# EAGLE design TourisTech (EAGLE 9.6.2)
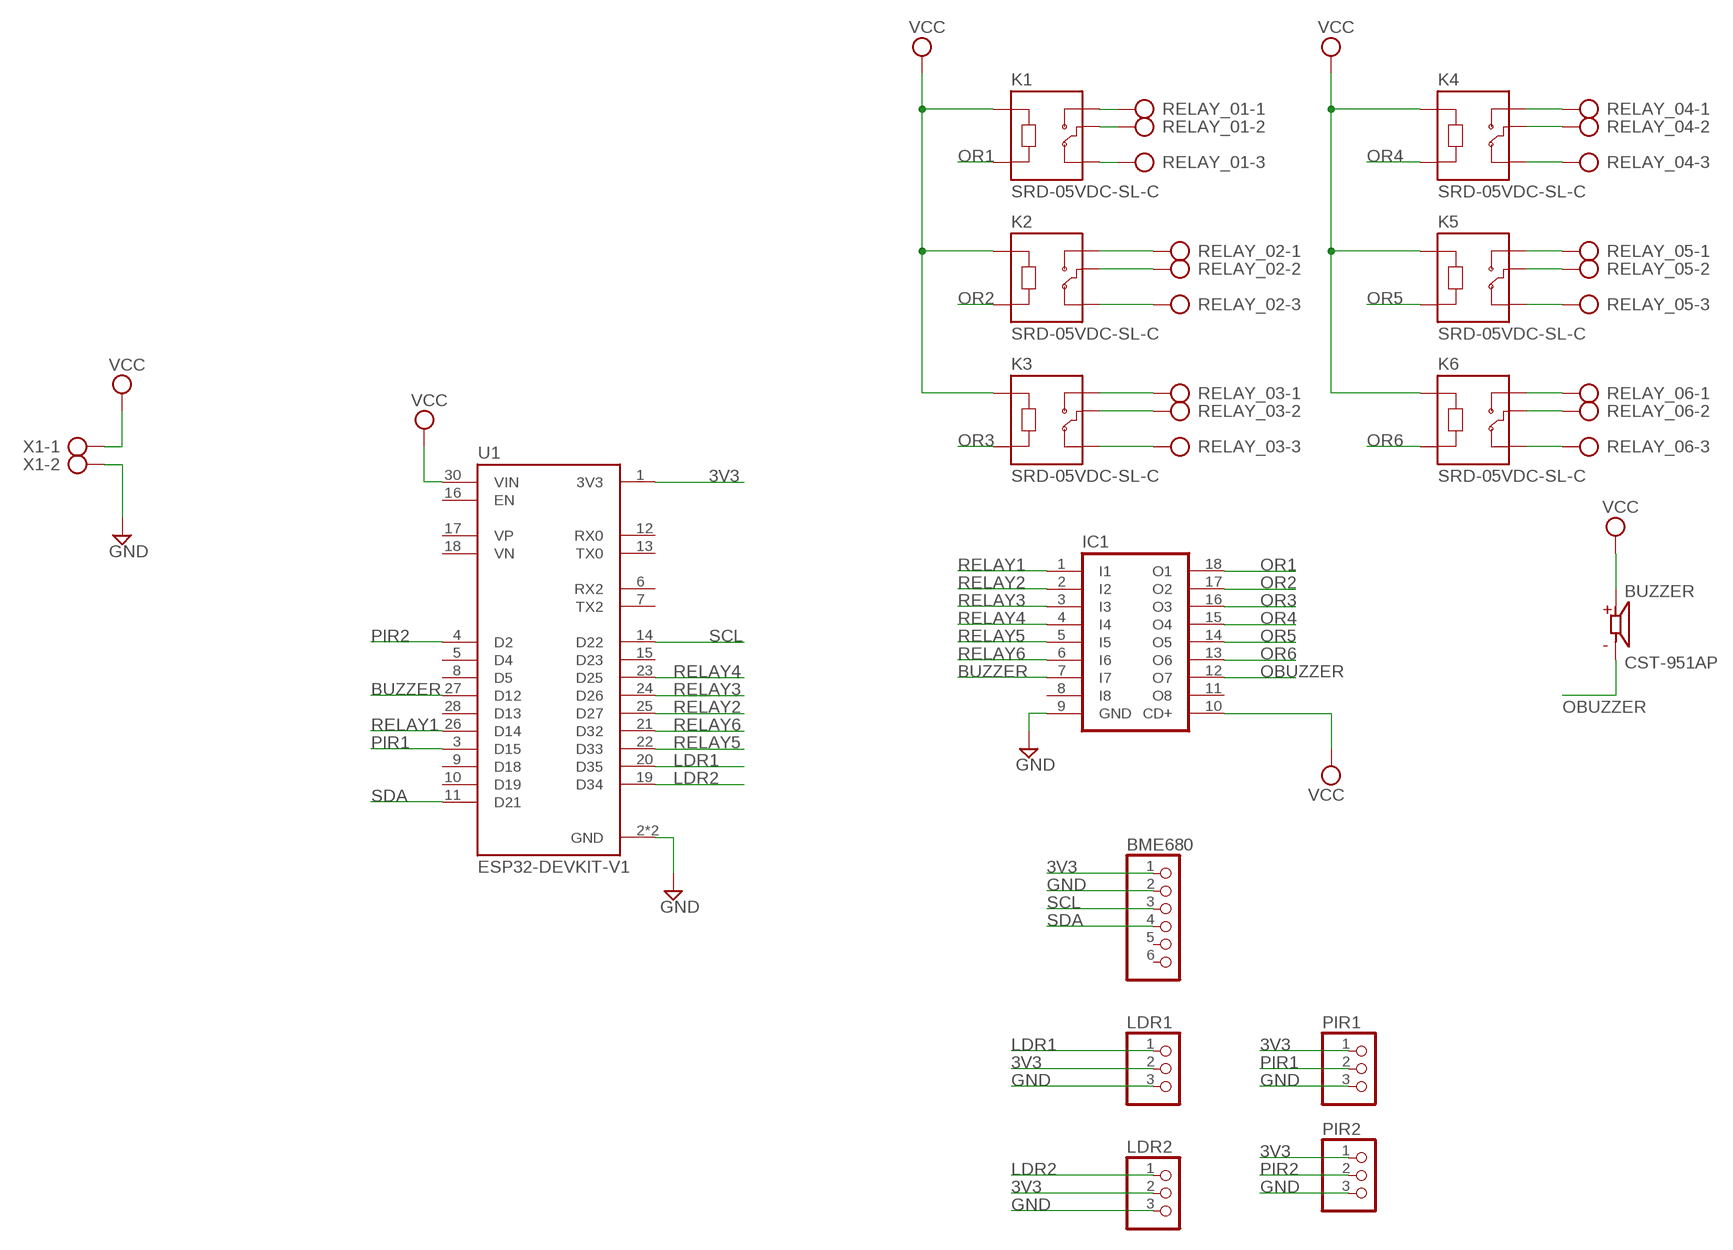
[diagram p0: schematic, sheet 1]

## Parts
BME680  PINHD-1X6  [1X06]
BUZZER  CST-951AP  [CUI_CST-951AP]
IC1  ULN2803A  [DIL18]
K1  SRD-05VDC-SL-C  [RELAY_SRD-05VDC-SL-C]
K2  SRD-05VDC-SL-C  [RELAY_SRD-05VDC-SL-C]
K3  SRD-05VDC-SL-C  [RELAY_SRD-05VDC-SL-C]
K4  SRD-05VDC-SL-C  [RELAY_SRD-05VDC-SL-C]
K5  SRD-05VDC-SL-C  [RELAY_SRD-05VDC-SL-C]
K6  SRD-05VDC-SL-C  [RELAY_SRD-05VDC-SL-C]
LDR1  PINHD-1X3  [1X03]
LDR2  PINHD-1X3  [1X03]
PIR1  PINHD-1X3  [1X03]
PIR2  PINHD-1X3  [1X03]
RELAY_01  AK300/3  [AK300/3]
RELAY_02  AK300/3  [AK300/3]
RELAY_03  AK300/3  [AK300/3]
RELAY_04  AK300/3  [AK300/3]
RELAY_05  AK300/3  [AK300/3]
RELAY_06  AK300/3  [AK300/3]
U1  ESP32-DEVKIT-V1  [MODULE_ESP32_DEVKIT_V1]
X1  AK300/2  [AK300/2]

## Nets
3V3: BME680.1 LDR1.2 LDR2.2 PIR1.1 PIR2.1 U1.1(3V3)
BUZZER: IC1.7(I7) U1.27(D12)
GND: BME680.2 IC1.9(GND) LDR1.3 LDR2.3 PIR1.3 PIR2.3 U1.2(GND) U1.29(GND) X1.2
LDR1: LDR1.1 U1.20(D35)
LDR2: LDR2.1 U1.19(D34)
N$1: K1.NO RELAY_01.1
N$2: K1.COM RELAY_01.2
N$3: K1.NC RELAY_01.3
N$4: K2.NO RELAY_02.1
N$5: K2.COM RELAY_02.2
N$6: K2.NC RELAY_02.3
N$7: K3.NO RELAY_03.1
N$8: K3.COM RELAY_03.2
N$9: K3.NC RELAY_03.3
N$10: K4.NO RELAY_04.1
N$11: K4.COM RELAY_04.2
N$12: K4.NC RELAY_04.3
N$13: K5.NO RELAY_05.1
N$14: K5.COM RELAY_05.2
N$15: K5.NC RELAY_05.3
N$16: K6.NO RELAY_06.1
N$17: K6.COM RELAY_06.2
N$18: K6.NC RELAY_06.3
OBUZZER: BUZZER.M IC1.12(O7)
OR1: IC1.18(O1) K1.A2
OR2: IC1.17(O2) K2.A2
OR3: IC1.16(O3) K3.A2
OR4: IC1.15(O4) K4.A2
OR5: IC1.14(O5) K5.A2
OR6: IC1.13(O6) K6.A2
PIR1: PIR1.2 U1.3(D15)
PIR2: PIR2.2 U1.4(D2)
RELAY1: IC1.1(I1) U1.26(D14)
RELAY2: IC1.2(I2) U1.25(D27)
RELAY3: IC1.3(I3) U1.24(D26)
RELAY4: IC1.4(I4) U1.23(D25)
RELAY5: IC1.5(I5) U1.22(D33)
RELAY6: IC1.6(I6) U1.21(D32)
SCL: BME680.3 U1.14(D22)
SDA: BME680.4 U1.11(D21)
VCC: BUZZER.P IC1.10(CD+) K1.A1 K2.A1 K3.A1 K4.A1 K5.A1 K6.A1 U1.30(VIN) X1.1
Unconnected: BME680.5 BME680.6 IC1.8(I8) IC1.11(O8) U1.5(D4) U1.6(RX2) U1.7(TX2) U1.8(D5) U1.9(D18) U1.10(D19) U1.12(RX0) U1.13(TX0) U1.15(D23) U1.16(EN) U1.17(VP) U1.18(VN) U1.28(D13)

## Library data of the parts
BME680 = pinhead:PINHD-1X6: PIN HEADER
BUZZER = CST-951AP:CST-951AP: 9 mm, 5 V, 85 dB, Through Hole, Magnetic Audio Transducer Buzzer Check availability <https://pricing.snapeda.com/parts/CST-951AP/CUI%20Devices/view-part?ref=eda>; AVAILABILITY: In Stock; CHECK_PRICES: https://www.snapeda.com/parts/CST-951AP/CUI+Devices/view-part/?ref=eda; CUI_PURCHASE_URL: https://www.cuidevices.com/product/audio/buzzers/audio-transducers/cst-951ap?utm_source=snapeda.com&utm_medium=referral&utm_campaign=snapedaBOM; DESCRIPTION: 9 mm, 5 V, 85 dB, Through Hole, Magnetic Audio Transducer Buzzer; MF: CUI Devices; MP: CST-951AP; PACKAGE: None; PRICE: None; PURCHASE-URL: https://pricing.snapeda.com/search?q=CST-951AP&ref=eda; SNAPEDA_LINK: https://www.snapeda.com/parts/CST-951AP/CUI+Devices/view-part/?ref=snap
IC1 = uln-udn:ULN2803A: DRIVER ARRAY
K1-K6 = SRD-05VDC-SL-C:SRD-05VDC-SL-C: 5V Trigger Relay Module For Arduino And Raspberry Pi 5V Trigger Relay Module For Arduino And Raspberry Pi Check availability <https://pricing.snapeda.com/parts/SRD-05VDC-SL-C/Songle%20Relay/view-part?ref=eda>; AVAILABILITY: Not in stock; CHECK_PRICES: https://www.snapeda.com/parts/SRD-05VDC-SL-C/Songle+Relay/view-part/?ref=eda; DESCRIPTION: 5V Trigger Relay Module For Arduino And Raspberry Pi 5V Trigger Relay Module For Arduino And Raspberry Pi; MF: Songle Relay; MP: SRD-05VDC-SL-C; PACKAGE: NON STANDARD-5 Songle Relay; PRICE: None; SNAPEDA_LINK: https://www.snapeda.com/parts/SRD-05VDC-SL-C/Songle+Relay/view-part/?ref=snap
LDR1 LDR2 PIR1 PIR2 = pinhead:PINHD-1X3: PIN HEADER
RELAY_01-RELAY_06 = con-ptr500:AK300/3: CONNECTOR; OC_FARNELL: unknown; OC_NEWARK: unknown
U1 = ESP32-DEVKIT-V1:ESP32-DEVKIT-V1: Dual core, Wi-Fi: 2.4 GHz up to 150 Mbits/s,BLE (Bluetooth Low Energy) and legacy Bluetooth, 32 bits, Up to 240 MHz Check availability <https://pricing.snapeda.com/parts/ESP32-DEVKIT-V1/Do%20it/view-part?ref=eda>; AVAILABILITY: Not in stock; CHECK_PRICES: https://www.snapeda.com/parts/ESP32-DEVKIT-V1/Do+it/view-part/?ref=eda; DESCRIPTION: Dual core, Wi-Fi: 2.4 GHz up to 150 Mbits/s,BLE (Bluetooth Low Energy) and legacy Bluetooth, 32 bits, Up to 240 MHz; MF: Do it; MP: ESP32-DEVKIT-V1; PACKAGE: None; PRICE: None; SNAPEDA_LINK: https://www.snapeda.com/parts/ESP32-DEVKIT-V1/Do+it/view-part/?ref=snap
X1 = con-ptr500:AK300/2: CONNECTOR; OC_FARNELL: unknown; OC_NEWARK: unknown

## Board
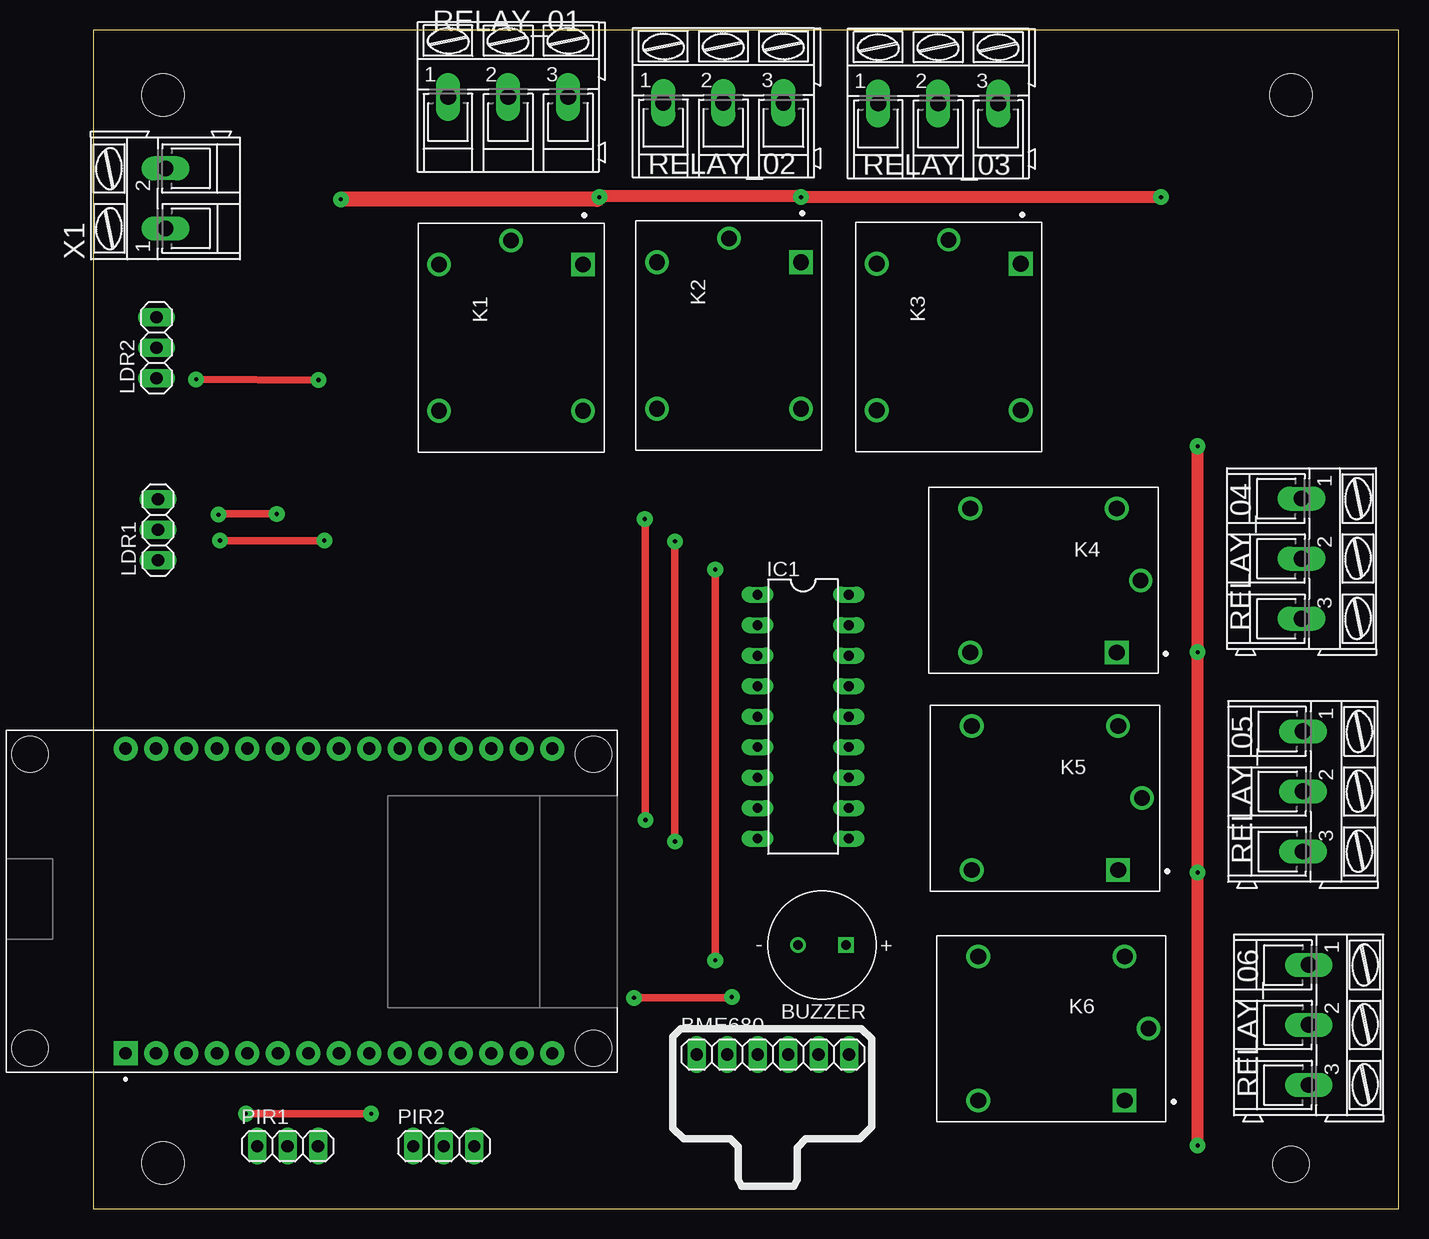
[diagram p1: board, top side]
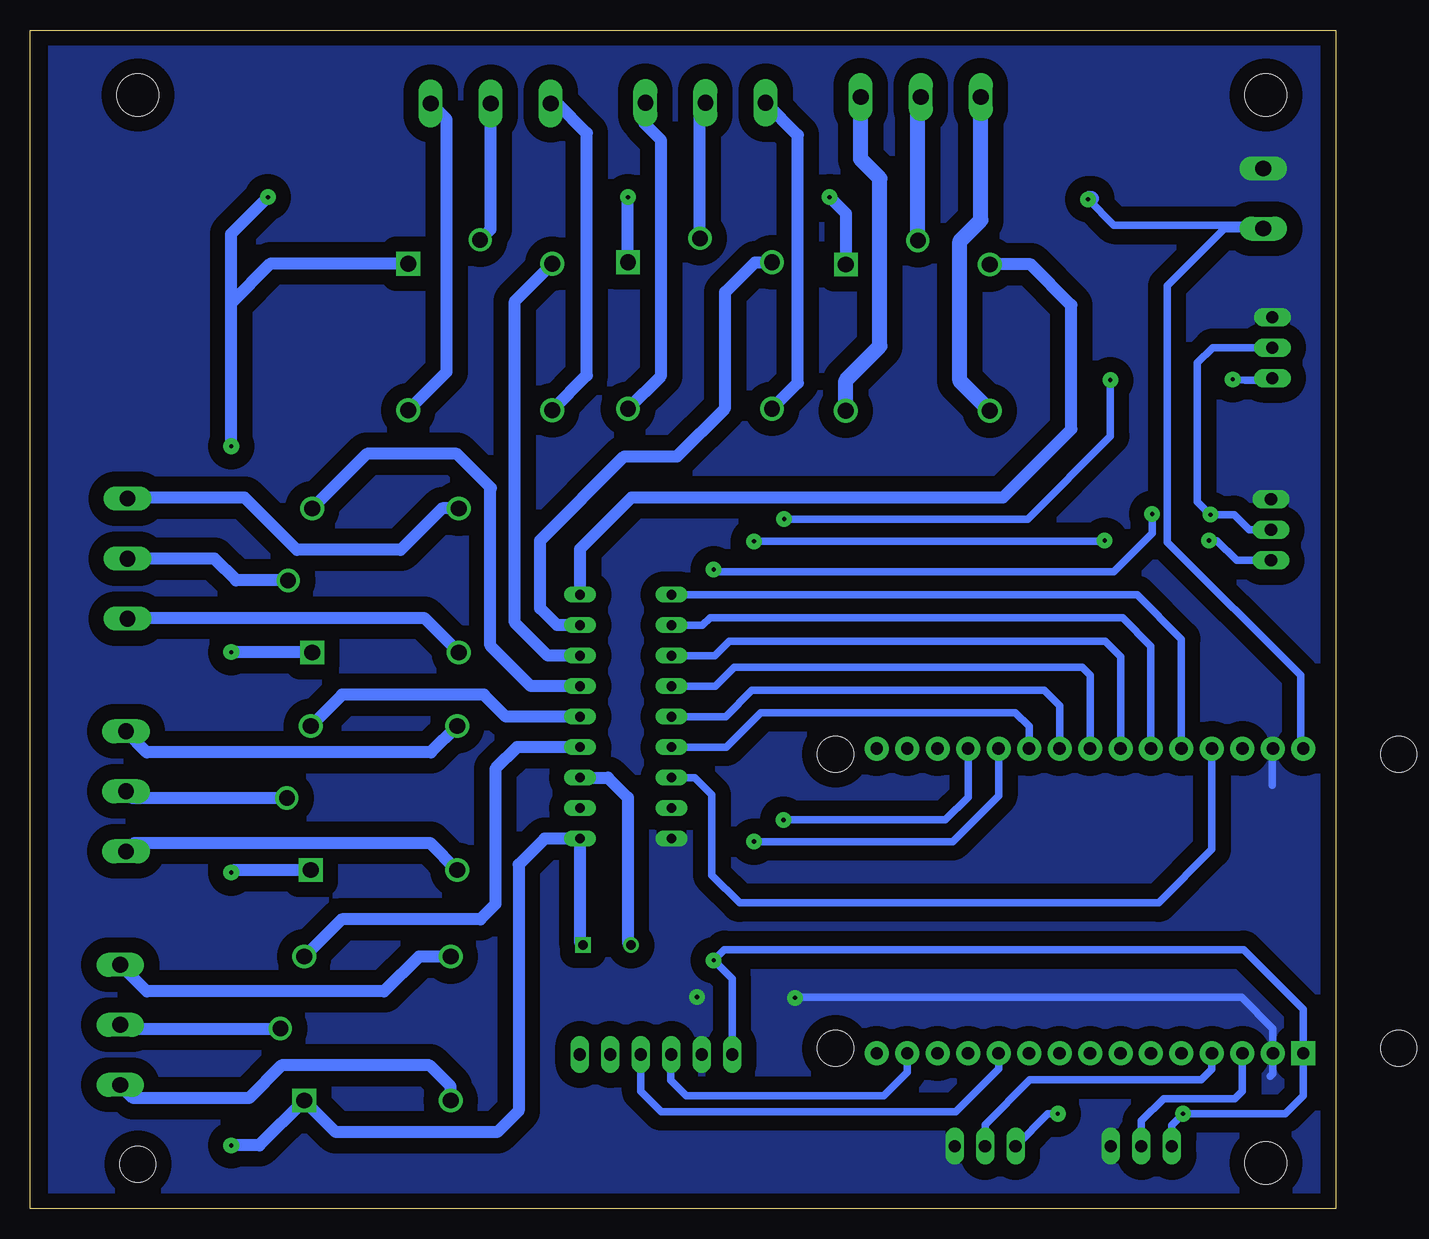
[diagram p2: board, bottom side, seen from below]

Size 108.81 x 98.23 mm. Coordinates in mm from the lower left corner, seen from the top.
Outline: 0,0 108.81,0 108.81,98.23 0,98.23 0,0
Copper layers (1*16): Top 0.035mm / dielectric 1.5mm / Bottom 0.035mm
Design rules "default *": minimum track width 6mil, minimum drill 0.35mm, track to track 6mil, track to pad 6mil, pad to pad 6mil, via to via 6mil, smd to smd 6mil, copper to edge 40mil, drill to drill 6mil, minimum pad ring 10mil, minimum via ring 8mil, stop-mask expansion 4mil, vias tented up to drill 0mil, thermal gap 0mil
Holes 3.5 mm at 5.82,3.82 99.82,92.82 5.82,92.82
Holes 3 mm at 99.82,3.72

### Footprints (pad centres in the part's own frame; a part is rotated, then mirrored left to right if it is on the bottom)
1X06 = drill 1.016 long: 1 -6.35,0; 2 -3.81,0; 3 -1.27,0; 4 1.27,0; 5 3.81,0; 6 6.35,0
CUI_CST-951AP = drill 0.8: M 2,0 | drill 0.8 square: P -2,0
DIL18 = drill 0.813 long: 1 -10.16,-3.81; 2 -7.62,-3.81; 3 -5.08,-3.81; 4 -2.54,-3.81; 5 0,-3.81; 6 2.54,-3.81; 7 5.08,-3.81; 8 7.62,-3.81; 9 10.16,-3.81; 10 10.16,3.81; 11 7.62,3.81; 12 5.08,3.81; 13 2.54,3.81; 14 0,3.81; 15 -2.54,3.81; 16 -5.08,3.81; 17 -7.62,3.81; 18 -10.16,3.81
RELAY_SRD-05VDC-SL-C = drill 1.32 square: A1 -6.1,6 | drill 1.32: A2 -6.1,-6; NC 6.1,6; NO 6.1,-6 | drill 1.29: COM -8.1,0
1X03 = drill 1.016 long: 1 -2.54,0; 2 0,0; 3 2.54,0
AK300/3 = drill 1.321 long: 1 -5.004,0; 2 0,0; 3 5.004,0
MODULE_ESP32_DEVKIT_V1 = drill 1.02 pad 2 square: 1 -12.7,15.515 | drill 1.02 pad 2: 2 -12.7,12.975; 3 -12.7,10.435; 4 -12.7,7.895; 5 -12.7,5.355; 6 -12.7,2.815; 7 -12.7,0.275; 8 -12.7,-2.265; 9 -12.7,-4.805; 10 -12.7,-7.345; 11 -12.7,-9.885; 12 -12.7,-12.425; 13 -12.7,-14.965; 14 -12.7,-17.505; 15 -12.7,-20.045; 16 12.7,-20.045; 17 12.7,-17.505; 18 12.7,-14.965; 19 12.7,-12.425; 20 12.7,-9.885; 21 12.7,-7.345; 22 12.7,-4.805; 23 12.7,-2.265; 24 12.7,0.275; 25 12.7,2.815; 26 12.7,5.355; 27 12.7,7.895; 28 12.7,10.435; 29 12.7,12.975; 30 12.7,15.515 | hole 3: -12.28,-23.475; 12.23,-23.475; 12.23,23.475; -12.28,23.475
AK300/2 = drill 1.321 long: 1 -2.515,0; 2 2.489,0

### Placement (x,y rotation side)
BME680  56.64,12.85 0 top
BUZZER  60.73,21.97 180 top
IC1  59.16,41.01 270 top
K1  34.82,72.59 270 top
K2  52.98,72.77 270 top
K3  71.29,72.65 270 top
K4  79.19,52.36 180 top
K5  79.31,34.23 180 top
K6  79.85,15.02 180 top
LDR1  5.4,56.58 90 top
LDR2  5.28,71.76 90 top
PIR1  16.2,5.22 0 top
PIR2  29.22,5.22 0 top
RELAY_01  34.58,92.65 0 top
RELAY_02  52.52,92.17 0 top
RELAY_03  70.42,92.11 0 top
RELAY_04  100.69,54.18 270 top
RELAY_05  100.81,34.78 270 top
RELAY_06  101.29,15.32 270 top
U1  18.21,25.65 90 top
X1  6.03,84.2 90 top

### Tracks (layer width: path | path; a pad name or v marks a point on that pad's centre or on a via)
3V3  (via drill 0.35 pad 1.3)
  Top 0.61: v51.84,20.7 v51.84,53.28 | v15.3,57.9 10.5,57.9 v10.44,57.84 | v12.72,7.92 v23.16,7.92
  Bottom 0.61: v51.84,53.28 51.66,53.1 18.48,53.1 15.3,56.28 v15.3,57.9 | LDR1.2 7.2,56.58 8.46,57.84 v10.44,57.84 11.52,58.92 11.52,70.5 10.26,71.76 LDR2.2 | BME680.1 50.29,19.15 v51.84,20.7 50.94,21.6 7.68,21.6 2.69,16.62 U1.1 2.69,9.43 4.2,7.92 v12.72,7.92 13.68,6.96 13.68,5.24 PIR1.1 | v23.16,7.92 23.98,7.92 PIR2.1
BUZZER
  Bottom 0.61: U1.27 10.31,29.95 14.76,25.5 49.68,25.5 51.99,27.81 51.99,34.49 53.43,35.93 IC1.7
GND  (via drill 0.35 pad 1.3)
  Top 0.61: v45.06,17.58 53.16,17.58 v53.22,17.64
  Bottom 0.61: U1.2 5.69,12.95 | U1.2 5.24,11.27 5.46,11.04 | U1.29 5.28,38.3 5.28,35.28 | U1.2 5.24,15.02 7.85,17.63 45.01,17.63 v45.06,17.58
  pour Bottom (isolate 1.27): 0.6,97.8 0.6,0.06 106.98,0.06 106.98,97.8
LDR1  (via drill 0.35 pad 1.3)
  Top 0.61: v48.48,30.6 v48.48,55.62 | v19.26,55.68 v10.56,55.68
  Bottom 0.61: U1.20 28.09,34.42 31.92,30.6 v48.48,30.6 | v48.48,55.62 19.32,55.62 v19.26,55.68 | v10.56,55.68 9.9,55.68 8.26,54.04 LDR1.1
LDR2  (via drill 0.35 pad 1.3)
  Top 0.61: v46.02,32.4 46.02,57.42 v45.96,57.48 | v18.78,69.06 v8.58,69.12
  Bottom 0.61: U1.19 30.64,34.29 32.52,32.4 v46.02,32.4 | v45.96,57.48 25.68,57.48 18.78,64.38 v18.78,69.06 | LDR2.1 5.44,69.06 7.56,69.06 8.56,69.1 v8.58,69.12
N$1
  Bottom 1.27: K1.NO 31.32,68.99 31.32,80.64 29.58,82.38 RELAY_01.1
N$2
  Bottom 1.27: K1.COM 34.82,92.41 RELAY_01.2
N$3
  Bottom 1.27: K1.NC 40.82,69.04 37.98,71.88 37.98,85.86 39.58,87.46 RELAY_01.3
N$4
  Bottom 1.016: K2.NO 44.82,68.83 44.82,89.47 RELAY_02.1
N$5
  Bottom 1.016: K2.COM 52.98,91.71 RELAY_02.2
N$6
  Bottom 1.016: K2.NC 56.22,69.43 56.22,89.04 57.6,90.42 57.6,92.09 RELAY_02.3
N$7
  Bottom 1.016: K3.NO 62.4,69.44 62.4,89.64 64.87,92.11 RELAY_03.1
N$8
  Bottom 1.016: K3.COM 70.42,81.62 RELAY_03.2
N$9
  Bottom 1.016: K3.NC 74.1,69.74 74.1,90.79 RELAY_03.3
N$10
  Bottom 1.016: K4.NO 74.46,58.36 77.92,54.9 86.57,54.9 90.93,59.26 100.61,59.26 RELAY_04.1
N$11
  Bottom 1.016: K4.COM 91.63,52.36 93.45,54.18 RELAY_04.2
N$12
  Bottom 1.016: K4.NC 75.97,49.24 100.63,49.24 RELAY_04.3
N$13
  Bottom 1.016: K5.NO 75.4,38.04 99.07,38.04 RELAY_05.1
N$14
  Bottom 1.016: K5.COM 100.27,34.24 RELAY_05.2
N$15
  Bottom 1.016: K5.NC 75.48,30.5 100.09,30.5 RELAY_05.3
N$16
  Bottom 1.016: K6.NO 76.39,21.02 79.3,18.11 99.08,18.11 RELAY_06.1
N$17
  Bottom 1.016: RELAY_06.2 100.99,15.02 K6.COM
N$18
  Bottom 1.016: K6.NC 73.75,10.19 75.5,11.94 87.86,11.94 90.58,9.22 100.19,9.22 RELAY_06.3
OBUZZER
  Bottom 1.016: IC1.12 60.65,35.93 58.98,34.26 58.98,22.2 58.75,21.97 BUZZER.M
OR1
  Bottom 1.016: IC1.18 62.97,54.99 58.68,59.28 27.72,59.28 22.02,64.98 22.02,75.3 25.41,78.69 K1.A2
OR2
  Bottom 1.016: IC1.17 64.89,48.63 66.3,50.04 66.3,55.68 59.28,62.7 54.9,62.7 50.88,66.72 50.88,76.38 48.39,78.87 K2.A2
OR3
  Bottom 1.016: IC1.16 65.65,46.09 68.4,48.84 68.4,75.64 K3.A2
OR4
  Bottom 1.016: IC1.15 67.07,43.55 70.44,46.92 70.44,60 70.38,60.06 73.23,62.91 80.74,62.91 K4.A2
OR5
  Bottom 1.016: IC1.14 69.15,41.01 70.98,42.84 82.8,42.84 K5.A2
OR6
  Bottom 1.016: IC1.13 68.21,38.47 70.02,36.66 70.02,25.38 71.28,24.12 82.85,24.12 K6.A2
PIR1
  Bottom 0.61: U1.3 7.78,9.8 8.4,9.18 14.34,9.18 16.2,7.32 PIR1.2
PIR2
  Bottom 0.61: PIR2.2 29.22,7.02 25.5,10.74 11.22,10.74 10.31,11.64 U1.4
RELAY1
  Bottom 0.61: U1.26 12.86,47.48 16.55,51.17 IC1.1
RELAY2
  Bottom 0.61: U1.25 15.39,46.9 17.76,49.26 52.14,49.26 52.77,48.63 IC1.2
RELAY3
  Bottom 0.61: IC1.3 51.75,46.09 50.55,47.29 19.21,47.29 17.93,46.02 U1.24
RELAY4
  Bottom 0.61: U1.23 20.48,44.48 21.11,45.11 50.13,45.11 51.69,43.55 IC1.4
RELAY5
  Bottom 0.61: U1.22 23.02,41.91 24.3,43.2 48.66,43.2 50.85,41.01 IC1.5
RELAY6
  Bottom 0.61: U1.21 25.55,40.2 26.7,41.34 47.92,41.34 50.79,38.47 IC1.6
SCL
  Bottom 0.61: U1.14 35.72,11.38 37.68,9.42 54.12,9.42 55.43,10.73 55.43,12.79 BME680.3
SDA
  Bottom 0.61: BME680.4 57.91,9.79 56.22,8.1 31.68,8.1 28.09,11.69 U1.11
VCC  (via drill 0.35 pad 1.3)
  Top 1.016: v92.04,5.28 v92.04,28.02 v92.04,46.38 v92.04,63.54 | v88.98,84.3 v58.98,84.3 58.92,84.36 42.24,84.36 v42.18,84.3
  Top 1.27: v42.18,84.3 42,84.12 v20.64,84.12
  Bottom 0.61: v20.64,84.12 18.48,81.96 6.31,81.96 X1.1 9.27,81.68 14.04,76.91 14.04,55.56 2.94,44.45 2.94,38.59 U1.30
  Bottom 1.016: BUZZER.P 62.97,22.21 IC1.10 65.93,30.85 68.1,28.68 68.1,8.16 69.88,6.38 83.31,6.38 K6.A1 89.69,5.28 v92.04,5.28 | v92.04,63.54 92.04,75.48 | 92.04,75.48 88.74,78.78 77.32,78.78 K3.A1 | 92.04,75.48 92.04,81.24 v88.98,84.3 | v42.18,84.3 40.82,82.94 K1.A1 | K2.A1 v58.98,84.3 | K5.A1 91.83,28.23 v92.04,28.02 | K4.A1 92.02,46.36 v92.04,46.38
  Bottom 1.27: 6.3,81.41 X1.1 | 20.34,84.18 20.58,84.18 v20.64,84.12